# Altium schematic sheet BUCK_5v_TPS54340_P-MOS.SchDoc
size A; SheetNumber: 1; SheetTotal: 7
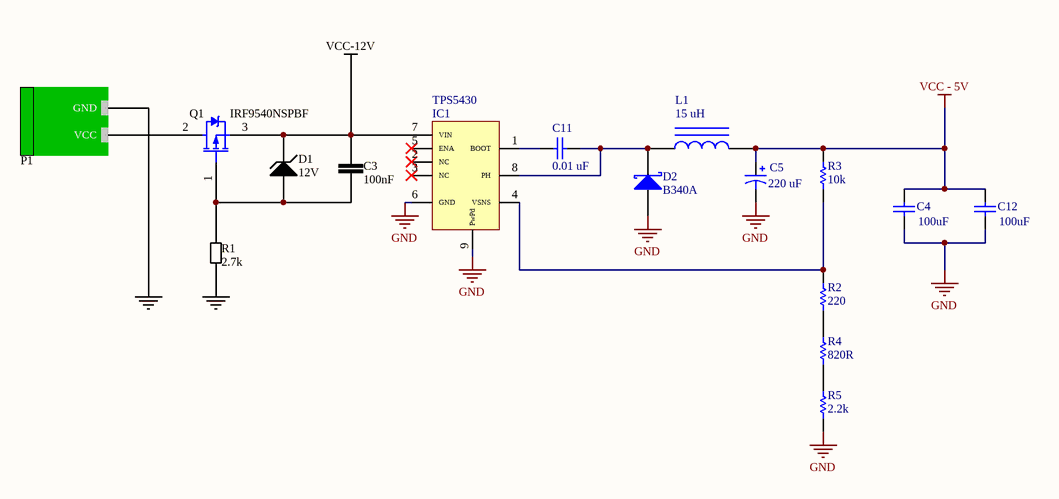
[diagram p0: BUCK_5v_TPS54340_P-MOS.SchDoc]

## Parts
C3  100nF  [CER_0805]
C4  value 100uF  [RAD-0.3]
C5  value 220 uF  [RB7.6-15]
C11  0.01 uF  [RAD-0.3]
C12  value 100uF  [RAD-0.3]
D1  12V  [DO214AC]
D2  B340A  [SMB]
IC1  TPS5430  [TPS5430]
L1  15 uH  [AXIAL-0.9]
P1  2EDGRC-5.08-02P-14-00A(H)  [PWR_Con]  (value not drawn)
Q1  IRF9540NSPBF  [D2PAK-2]
R1  2.7k  [RESC2013X38N-0805-NOOVERLAY]
R2  220  [AXIAL-0.3]
R3  10k  [AXIAL-0.3]
R4  value 820R  [AXIAL-0.3]
R5  value 2.2k  [AXIAL-0.3]

## Nets
GND: C4.1 C5.2 C12.1 D2.1(A) IC1.6(GND) IC1.9(PwPd) P1.1(GND) R1.1 R5.1
VCC - 5V: C4.2 C5.1 C12.2 L1.2 R3.2
VCC-12V: C3.2 D1.1(Cathode) IC1.7(VIN) Q1.3(S)
NetC3_1: C3.1 D1.2(Anode) Q1.1(G) R1.2
NetC11_1: C11.1 IC1.1(BOOT)
NetC11_2: C11.2 D2.2(K) IC1.8(PH) L1.1
NetIC1_4: IC1.4(VSNS) R2.2 R3.1
NetP1_2: P1.2(VCC) Q1.2(D)
NetR2_1: R2.1 R4.2
NetR4_1: R4.1 R5.2

Not connected (* = marked no-connect by the designer): IC1 2(NC)* 3(NC)* 5(ENA)*

## Library data of the parts
C3 = 00002105: CAP CER 100n 50V X7R 10% 0805; Capacitance: 100nF
C4 C11 C12 = Cap: Capacitor; Published: 8-Jun-2000; LatestRevisionDate: 17-Jul-2002; LatestRevisionNote: Re-released for DXP Platform.; PackageReference: RAD-0.3; Publisher: Altium Limited; PackageDescription: Radial Cap, Thru-Hole; 2 Leads; 0.3 in Pin Spacing
C5 = Cap Pol1: Polarized Capacitor (Radial); Published: 8-Jun-2000; LatestRevisionDate: 17-Jul-2002; LatestRevisionNote: Re-released for DXP Platform.; PackageReference: RB7.6-15; Publisher: Altium Limited; PackageDescription: Polarized Capacitor (Radial); 2 Leads
D1 = ZENER: DIODE ZENER; Manufacturer: Vishay Semiconductor Diodes Division; Manufacturer Part Number: B360B; Barcode: 0100000007488; id: 62; Assembly: SMD; Speed: Fast Recovery =< 500ns, > 200mA (Io); Voltage  DC Reverse: 60V; Current  Average Rectified: 3A; Voltage  Forward: 550mV @ 3A; Diode Type: Schottky; item_id: 1025; Recommended Rating: Silver; Category: Discrete Semiconductor Products; Datasheet URL: http://www.vishay.com/docs/88896/b330la.pdf; Package Case: DO-214AC, SMA; Family: DIODE; Part Type: Discrete Semiconductors; Refferent Voltage: 12V
D2 = D Schottky: Schottky Diode; Published: 8-Jun-2000; LatestRevisionDate: 17-Jul-2002; LatestRevisionNote: Re-released for DXP Platform.; PackageReference: SMB; Publisher: Altium Limited; PackageDescription: DO-214-AA/SMB; 2 C-Bend Leads; Body 5.3 x 3.6 mm, inc. leads (LxW); Code_JEDEC: DO-214-AA
IC1 = TPS543?: Part Number: TPS5430; Parameter 2: *
L1 = Inductor Iron: Magnetic-Core Inductor; Published: 24-Mar-1999; LatestRevisionDate: 17-Jul-2002; LatestRevisionNote: Re-released for DXP Platform.; PackageReference: AXIAL-0.9; Publisher: Altium Limited; PackageDescription: Axial Device, Thru-Hole; 2 Leads; 0.9 in Pin Spacing
P1 = 00000002: TERM BLOCK HDR 2POS 90DEG 5.08MM; Suplier: TME; Manufacturer Part Number: 2EDGRC-5.08-02P-14-00A(H); Suplier Product Link: https://www.tme.eu/en/details/2edgrc5.08-2p14/pluggable-terminal-blocks/degson-electronics/2edgrc-508-02p-14-00ah/; Price: 0.1304
Q1 = IRF9540N: P-MOS; Manufacturer: INTERNATIONAL RECTIFIER; Manufacturer Part Number: IRF9540NSPBF; Order Code: IRF9540NS; Package: TO-263 SMD; Price: DIN 62.54; Supplier: Comet.rs
R1 = 00002701: RES SMD 2.7 kOhm 1/8W 0805; Power: 0.125W, 1/8W; Barcode: 00004701; Resistance: 2.7k; Assembly: SMD
R2-R5 = Res1: Resistor; Published: 8-Jun-2000; LatestRevisionDate: 17-Jul-2002; LatestRevisionNote: Re-released for DXP Platform.; PackageReference: AXIAL-0.3; Publisher: Altium Limited; PackageDescription: Axial Device, Thru-Hole; 2 Leads; 0.3 in Pin Spacing